# EasyEDA Pro project bldc_driver_board_easyeda_2.eprj, schematic Schematic1
Create Date: 2024-05-04; Page Name: P1; Project Name: bldc_driver_board_easyeda_2; Schematic Name: Schematic1; Update Date: 2024-05-10; Company: EasyEDA.com; Drawn: EasyEDA; Page Size: A4; Part Number: JLCPCB-002; Reviewed: EasyEDA; Version: V0.1
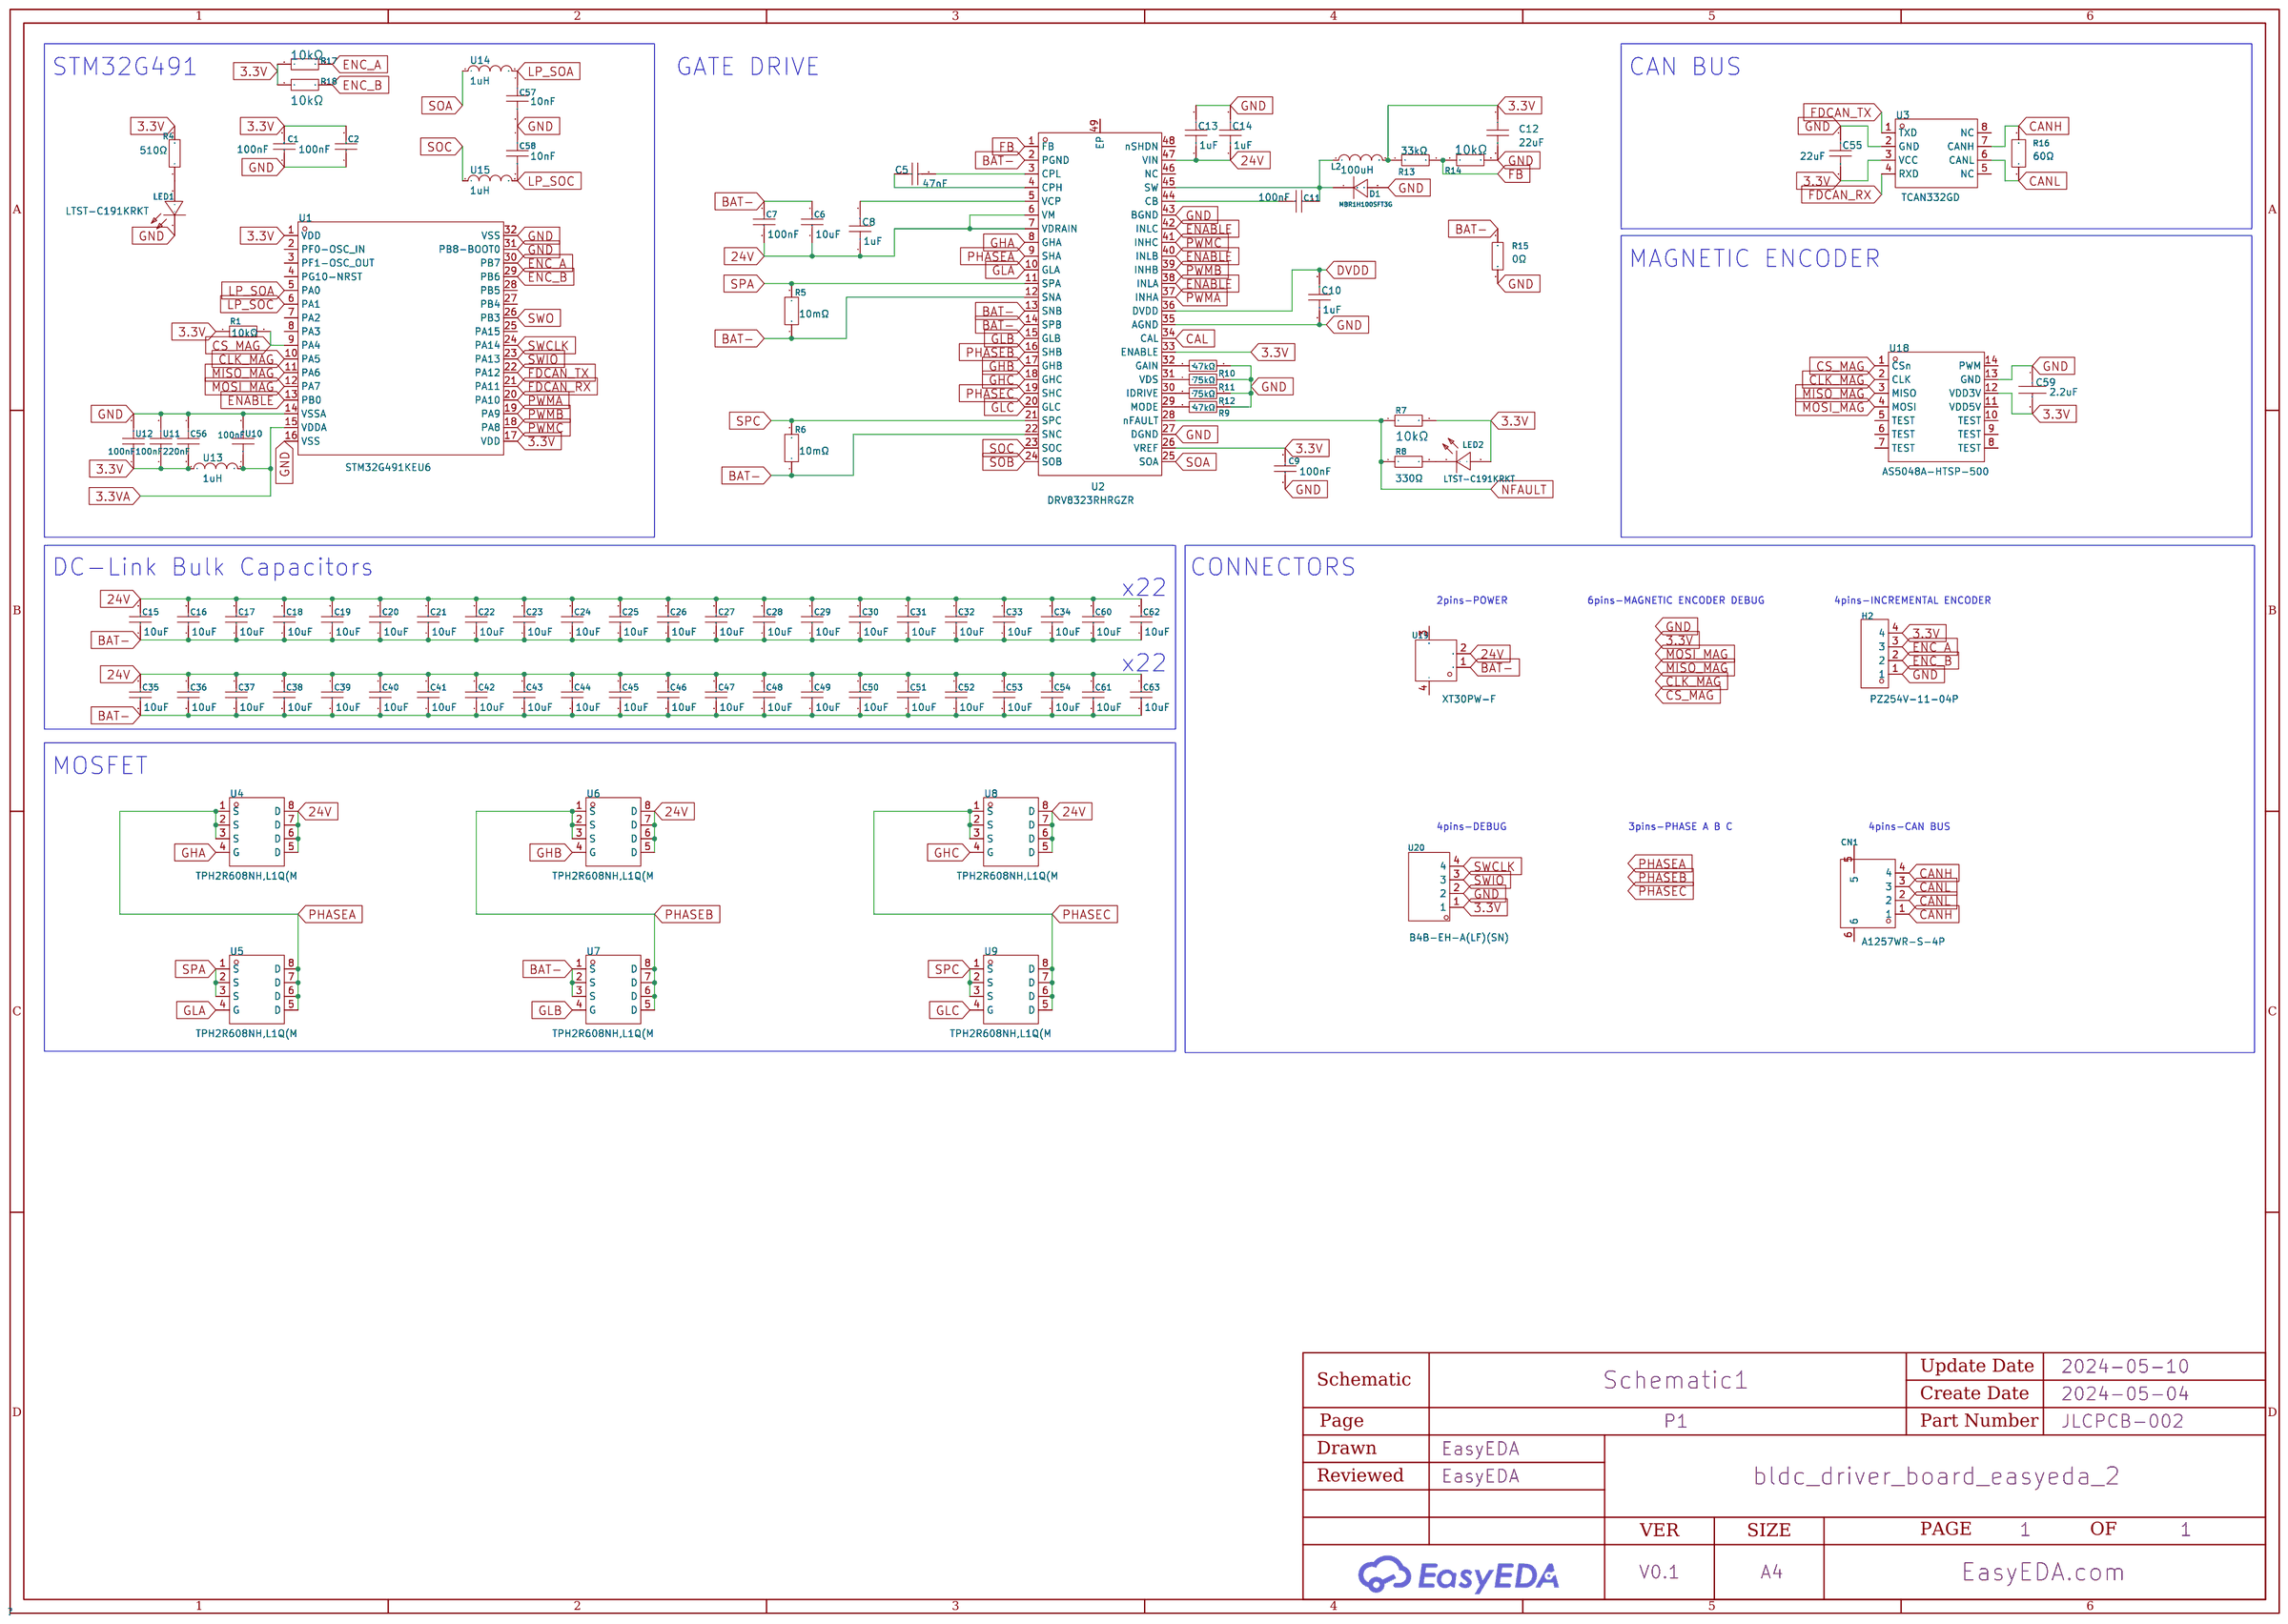
[diagram p0: schematic sheet]

## Parts
C1  100nF  [C0603]
C2  100nF  [C0603]
C5  47nF  [C0805]
C6  10uF  [C1206]
C7  100nF  [C1206]
C8  1uF  [C0603]
C9  100nF  [C0603]
C10  1uF  [C0603]
C11  100nF  [C1206]
C12  22uF  [C0603]
C13  1uF  [C0603]
C14  1uF  [C0603]
C15  10uF  [C1206]
C16  10uF  [C1206]
C17  10uF  [C1206]
C18  10uF  [C1206]
C19  10uF  [C1206]
C20  10uF  [C1206]
C21  10uF  [C1206]
C22  10uF  [C1206]
C23  10uF  [C1206]
C24  10uF  [C1206]
C25  10uF  [C1206]
C26  10uF  [C1206]
C27  10uF  [C1206]
C28  10uF  [C1206]
C29  10uF  [C1206]
C30  10uF  [C1206]
C31  10uF  [C1206]
C32  10uF  [C1206]
C33  10uF  [C1206]
C34  10uF  [C1206]
C35  10uF  [C1206]
C36  10uF  [C1206]
C37  10uF  [C1206]
C38  10uF  [C1206]
C39  10uF  [C1206]
C40  10uF  [C1206]
C41  10uF  [C1206]
C42  10uF  [C1206]
C43  10uF  [C1206]
C44  10uF  [C1206]
C45  10uF  [C1206]
C46  10uF  [C1206]
C47  10uF  [C1206]
C48  10uF  [C1206]
C49  10uF  [C1206]
C50  10uF  [C1206]
C51  10uF  [C1206]
C52  10uF  [C1206]
C53  10uF  [C1206]
C54  10uF  [C1206]
C55  22uF  [C0603]
C56  220nF  [C0603]
C57  10nF  [C0603]
C58  10nF  [C0603]
C59  2.2uF  [C0402]
C60  10uF  [C1206]
C61  10uF  [C1206]
C62  10uF  [C1206]
C63  10uF  [C1206]
CN1  A1257WR-S-4P  [CONN-SMD_A1257WR-S-4P]
D1  MBR1H100SFT3G  [SOD-123F_L2.8-W1.8-LS3.7-RD]
H2  PZ254V-11-04P  [HDR-TH_4P-P2.54-V-M]
L2  100uH  [IND-SMD_L4.0-W4.0]
LED1  LTST-C191KRKT  [LED0603-RD]
LED2  LTST-C191KRKT  [LED0603-RD]
R1  10kΩ  [R0603]
R4  510Ω  [R0603]
R5  10mΩ  [RES-SMD_L6.4-W3.2-R2512]
R6  10mΩ  [RES-SMD_L6.4-W3.2-R2512]
R7  10kΩ  [R0603]
R8  330Ω  [R0603]
R9  47kΩ  [R0603]
R10  47kΩ  [R0603]
R11  75kΩ  [R0603]
R12  75kΩ  [R0603]
R13  33kΩ  [R0603]
R14  10kΩ  [R0603]
R15  0Ω  [R1206]
R16  60Ω  [R0603]
R17  10kΩ  [R0603]
R18  10kΩ  [R0603]
U1  STM32G491KEU6  [UFQFPN-32_L5.0-W5.0-P0.50-TL-1]
U2  DRV8323RHRGZR  [VQFN-48_L7.0-W7.0-P0.50-TL-EP5.1]
U3  TCAN332GD  [SOIC-8_L4.9-W3.9-P1.27-LS6.0-BL]
U4  TPH2R608NH,L1Q(M  [POWERVDFN-8_L5.0-W5.0-P1.27-LS6.0-BL]
U5  TPH2R608NH,L1Q(M  [POWERVDFN-8_L5.0-W5.0-P1.27-LS6.0-BL]
U6  TPH2R608NH,L1Q(M  [POWERVDFN-8_L5.0-W5.0-P1.27-LS6.0-BL]
U7  TPH2R608NH,L1Q(M  [POWERVDFN-8_L5.0-W5.0-P1.27-LS6.0-BL]
U8  TPH2R608NH,L1Q(M  [POWERVDFN-8_L5.0-W5.0-P1.27-LS6.0-BL]
U9  TPH2R608NH,L1Q(M  [POWERVDFN-8_L5.0-W5.0-P1.27-LS6.0-BL]
U10  100nF  [C0603]
U11  100nF  [C0603]
U12  100nF  [C0603]
U13  1uH  [L0603]
U14  1uH  [L0603]
U15  1uH  [L0603]
U18  AS5048A-HTSP-500  [TSSOP-14_L5.0-W4.4-P0.65-LS6.4-BL]
U19  XT30PW-F  [CONN-TH_XT30PW-F-1]
U20  B4B-EH-A(LF)(SN)  [CONN-TH_B4B-EH-A-LF-SN]

## Library data of the parts
C1 C2 C9 = CL10B104KO8NNNC: Capacitance: Tolerance:±10% Tolerance:±10% Voltage Rated: Temperature Coefficient:; LCSC Part Name: 100nF ±10% 16V; Supplier Part: C66501; Manufacturer: SAMSUNG(三星); Supplier Footprint: 0603; JLCPCB Part Class: Extended Part; Datasheet: https://atta.szlcsc.com/upload/public/pdf/source/20160218/1457707763339.pdf; Supplier: LCSC; Tolerance: ±10%
C5 = 0805B473K500NT: Capacitance:47nF Tolerance:±10% Tolerance:±10% Voltage Rated: Temperature Coefficient:; LCSC Part Name: 47nF ±10% 50V; Supplier Part: C1745; Manufacturer: FH(风华); Supplier Footprint: 0805; JLCPCB Part Class: Extended Part; Datasheet: https://atta.szlcsc.com/upload/public/pdf/source/20200305/C486355_26A10D38EF8C2A5C37091D0039909270.pdf; Supplier: LCSC; Tolerance: ±10%
C6 C15-C54 C60-C63 = CL31A106KBHNNNE: Capacitance: Tolerance:±10% Tolerance:±10% Voltage Rated: Temperature Coefficient:; LCSC Part Name: 10uF ±10% 50V; Supplier Part: C13585; Manufacturer: SAMSUNG(三星); Supplier Footprint: 1206; JLCPCB Part Class: Basic Part; Datasheet: https://atta.szlcsc.com/upload/public/pdf/source/20160218/1457707763339.pdf; Supplier: LCSC; Tolerance: ±10%
C7 C11 = 1206B104K500NT: Capacitance:100nF Tolerance:±10% Tolerance:±10% Voltage Rated: Temperature Coefficient:; LCSC Part Name: 100nF ±10% 50V; Supplier Part: C110253; Manufacturer: FH(风华); Supplier Footprint: 1206; JLCPCB Part Class: Extended Part; Datasheet: https://atta.szlcsc.com/upload/public/pdf/source/20200305/C486355_26A10D38EF8C2A5C37091D0039909270.pdf; Supplier: LCSC; Tolerance: ±10%
C8 C10 C13 C14 = CL10A105KB8NNNC: Capacitance: Tolerance:±10% Tolerance:±10% Voltage Rated: Temperature Coefficient:; LCSC Part Name: 1uF ±10% 50V; Supplier Part: C15849; Manufacturer: SAMSUNG(三星); Supplier Footprint: 0603; JLCPCB Part Class: Basic Part; Datasheet: https://atta.szlcsc.com/upload/public/pdf/source/20160218/1457707763339.pdf; Supplier: LCSC; Tolerance: ±10%
C12 C55 = CL10A226MQ8NRNE: Capacitance: Tolerance:±20% Tolerance:±20% Voltage Rated: Temperature Coefficient:; LCSC Part Name: 22uF ±20% 6.3V; Supplier Part: C159801; Manufacturer: SAMSUNG(三星); Supplier Footprint: 0603; JLCPCB Part Class: Extended Part; Datasheet: https://atta.szlcsc.com/upload/public/pdf/source/20160218/1457707763339.pdf; Supplier: LCSC; Tolerance: ±20%
C56 = CL10B224KA8NNNC: Capacitance: Tolerance:±10% Tolerance:±10% Voltage Rated: Temperature Coefficient:; LCSC Part Name: 220nF ±10% 25V; Supplier Part: C21120; Manufacturer: SAMSUNG(三星); Supplier Footprint: 0603; JLCPCB Part Class: Basic Part; Datasheet: https://atta.szlcsc.com/upload/public/pdf/source/20160218/1457707763339.pdf; Supplier: LCSC; Tolerance: ±10%
C57 C58 = CC0603KRX7R9BB103: Capacitance: Tolerance:±10% Tolerance:±10% Voltage Rated: Temperature Coefficient:; LCSC Part Name: 10nF ±10% 50V; Supplier Part: C100042; Manufacturer: YAGEO(国巨); Supplier Footprint: 0603; JLCPCB Part Class: Extended Part; Datasheet: https://atta.szlcsc.com/upload/public/pdf/source/20181008/C309510_22F155564471FAF6A489F7D68F34234E.pdf; Supplier: LCSC; Tolerance: ±10%
C59 = CL05A225MQ5NSNC: Capacitance: Tolerance:±20% Tolerance:±20% Voltage Rated: Temperature Coefficient:; LCSC Part Name: 2.2uF ±20% 6.3V; Supplier Part: C12530; Manufacturer: SAMSUNG(三星); Supplier Footprint: 0402; JLCPCB Part Class: Basic Part; Datasheet: https://atta.szlcsc.com/upload/public/pdf/source/20160218/1457707763339.pdf; Supplier: LCSC; Tolerance: ±20%
CN1 = A1257WR-S-4P: Pins Structure:1x4P Pitch:1.25mm Mounting Style:- Reference Series:GH Number of Pins:4P Number of Rows:1 Number of PINs Per Row:4 Row Spacing:- Contact Material:Brass; LCSC Part Name: 系列:GH 间距:1.25mm 1x4P; Supplier Part: C225127; Manufacturer: CJT(长江连接器); Supplier Footprint: SMD,P=1.25mm; JLCPCB Part Class: Extended Part; Datasheet: https://atta.szlcsc.com/upload/public/pdf/source/20181008/C272994_C9E89FA8A36D0009CAD30AD8C59C2782.pdf; Supplier: LCSC; Pins Structure: 1x4P; Pitch: 1.25mm; Reference Series: GH; Number of Pins: 4P; Number of Rows: 1; Number of PINs Per Row: 4; Contact Material: Brass
D1 = MBR1H100SFT3G: Forward Voltage (Vf@If):760mV@1A Reverse Voltage (Vr):100V Average Rectified Current (Io):1A Reverse Leakage Current (Ir):40uA@100V; LCSC Part Name: 电压:100V 电流:1A; Supplier Part: C235757; Manufacturer: onsemi(安森美); Supplier Footprint: SOD-123FL; JLCPCB Part Class: Extended Part; Datasheet: https://atta.szlcsc.com/upload/public/pdf/source/20221020/1153CD973F1751438771FE3485A9D615.pdf; Supplier: LCSC; Forward Voltage (Vf@If): 760mV@1A; Reverse Voltage (Vr): 100V; Average Rectified Current (Io): 1A; Reverse Leakage Current (Ir): 40uA@100V
H2 = PZ254V-11-04P_C492403: Pin Structure:1x4P Pitch:2.54mm Row Spacing:- Circluar Pins/Square Pins:Square Pins Mounting Type:Straight Number of Rows:Plugin Number of Pins:4P Current Rating (Max):- Voltage Rating (Max):- Length of Mating Pin:6mm Insulation Height:2.5mm Length of End; LCSC Part Name: 间距:2.54mm 1x4P 直插 方针; Supplier Part: C492403; Manufacturer: XFCN(兴飞); Supplier Footprint: 插件,P=2.54mm; JLCPCB Part Class: Extended Part; Datasheet: https://atta.szlcsc.com/upload/public/pdf/source/20200309/C492403_F9F19131791D08044AD4F84F8E751A34.pdf; Supplier: LCSC; Pin Structure: 1x4P; Pitch: 2.54mm; Circluar Pins/Square Pins: Square Pins; Mounting Type: Straight; Number of Rows: Plugin; Number of Pins: 4P; Length of Mating Pin: 6mm; Insulation Height: 2.5mm; Length of End Connection Pin: 3mm; Operating Temperature Range: -40℃~+105℃; Color: Black
L2 = ASPIAIG-S4035-101M-T: Inductance:100uH Tolerance:±20% Tolerance:±20% Rated Current: Saturation Current (Isat):750mA DC Resistance (DCR): Ratings:AEC-Q200; LCSC Part Name: 100uH ±20% 750mA; Supplier Part: C1334632; Manufacturer: ABRACON; Supplier Footprint: SMD,4x4mm; JLCPCB Part Class: Extended Part; Datasheet: https://atta.szlcsc.com/upload/public/pdf/source/20210702/86CE89ECC75CFDE29082610D72370976.pdf; Supplier: LCSC; Tolerance: ±20%; Saturation Current (Isat): 750mA; Ratings: AEC-Q200
LED1 LED2 = LTST-C191KRKT: Emitted Color:Red Forward Voltage (VF):2V Forward Voltage (VF):2V Power Dissipation:75mW Forward Current:20mA Dominant Wavelength:631nm Dominant Wavelength:631nm Peak Wavelength:639nm Diode Configuration:- Lens Color:无色透明透镜 Color Temperature:- Color Tempe; LCSC Part Name: 红灯; Supplier Part: C125099; Manufacturer: LITEON(光宝); Supplier Footprint: 0603; JLCPCB Part Class: Extended Part; Datasheet: https://atta.szlcsc.com/upload/public/pdf/source/20180129/C125099_15171878294931315872.pdf; Supplier: LCSC; Emitted Color: Red; Forward Voltage (VF): 2V; Power Dissipation: 75mW; Forward Current: 20mA; Dominant Wavelength: 631nm; Peak Wavelength: 639nm; Lens Color: 无色透明透镜; Luminous Intensity: 54mcd; Viewing Angle: 130°; Operating Temperature: -55℃~+85℃
R1 R7 R14 R17 R18 = 0603WAF1002T5E: Type:Thick Film Resistors Resistance:10kΩ Tolerance:±1% Tolerance:±1% Power(Watts): Overload Voltage (Max): Temperature Coefficient:±100ppm/℃ Temperature Coefficient:±100ppm/℃ Operating Temperature Range:-55℃~+155℃ Operating Temperature Range:-55℃~+155℃; LCSC Part Name: 厚膜电阻 10kΩ ±1% 100mW; Supplier Part: C25804; Manufacturer: UNI-ROYAL(厚声); Supplier Footprint: 0603; JLCPCB Part Class: Basic Part; Datasheet: https://atta.szlcsc.com/upload/public/pdf/source/20200306/C422600_1E6D84923E4A46A82E41ADD87F860B5C.pdf; Supplier: LCSC; Type: Thick Film Resistors; Tolerance: ±1%; Temperature Coefficient: ±100ppm/℃; Operating Temperature Range: -55℃~+155℃
R4 = 0603WAF5100T5E: Type:Thick Film Resistors Resistance: Tolerance:±1% Tolerance:±1% Power(Watts): Overload Voltage (Max): Temperature Coefficient:±100ppm/℃ Temperature Coefficient:±100ppm/℃ Operating Temperature Range:-55℃~+155℃ Operating Temperature Range:-55℃~+155℃; LCSC Part Name: 510Ω ±1% 100mW 厚膜电阻; Supplier Part: C23193; Manufacturer: UNI-ROYAL(厚声); Supplier Footprint: 0603; JLCPCB Part Class: Basic Part; Datasheet: https://atta.szlcsc.com/upload/public/pdf/source/20200306/C422600_1E6D84923E4A46A82E41ADD87F860B5C.pdf; Supplier: LCSC; Type: Thick Film Resistors; Tolerance: ±1%; Temperature Coefficient: ±100ppm/℃; Operating Temperature Range: -55℃~+155℃
R5 R6 = HoJLR2512-3W-10mR-1%: Type:Current Sensing Resistors Resistance:10mΩ Tolerance:±1% Tolerance:±1% Power(Watts): Mounting Sytle:Surface Mount; LCSC Part Name: 10mΩ ±1% 3W; Supplier Part: C2903468; Manufacturer: Milliohm(毫欧); Supplier Footprint: 2512; JLCPCB Part Class: Extended Part; Datasheet: https://atta.szlcsc.com/upload/public/pdf/source/20211009/7525CABAB363C979E942C1DD41F1FEF0.pdf; Supplier: LCSC; Type: Current Sensing Resistors; Tolerance: ±1%; Mounting Sytle: Surface Mount
R8 = 0603WAF3300T5E: Type:Thick Film Resistors Resistance: Tolerance:±1% Tolerance:±1% Power(Watts): Overload Voltage (Max): Temperature Coefficient:±100ppm/℃ Temperature Coefficient:±100ppm/℃ Operating Temperature Range:-55℃~+155℃ Operating Temperature Range:-55℃~+155℃; LCSC Part Name: 330Ω ±1% 100mW 厚膜电阻; Supplier Part: C23138; Manufacturer: UNI-ROYAL(厚声); Supplier Footprint: 0603; JLCPCB Part Class: Basic Part; Datasheet: https://atta.szlcsc.com/upload/public/pdf/source/20200306/C422600_1E6D84923E4A46A82E41ADD87F860B5C.pdf; Supplier: LCSC; Type: Thick Film Resistors; Tolerance: ±1%; Temperature Coefficient: ±100ppm/℃; Operating Temperature Range: -55℃~+155℃
R9 R10 = 0603WAF4702T5E: Type:Thick Film Resistors Resistance:47kΩ Tolerance:±1% Tolerance:±1% Power(Watts): Overload Voltage (Max): Temperature Coefficient:±100ppm/℃ Temperature Coefficient:±100ppm/℃ Operating Temperature Range:-55℃~+155℃ Operating Temperature Range:-55℃~+155℃; LCSC Part Name: 47kΩ ±1% 100mW 厚膜电阻; Supplier Part: C25819; Manufacturer: UNI-ROYAL(厚声); Supplier Footprint: 0603; JLCPCB Part Class: Basic Part; Datasheet: https://atta.szlcsc.com/upload/public/pdf/source/20200306/C422600_1E6D84923E4A46A82E41ADD87F860B5C.pdf; Supplier: LCSC; Type: Thick Film Resistors; Tolerance: ±1%; Temperature Coefficient: ±100ppm/℃; Operating Temperature Range: -55℃~+155℃
R11 R12 = 0603WAF7502T5E: Type:Thick Film Resistors Resistance:75kΩ Tolerance:±1% Tolerance:±1% Power(Watts): Overload Voltage (Max): Temperature Coefficient:±100ppm/℃ Temperature Coefficient:±100ppm/℃ Operating Temperature Range:-55℃~+155℃ Operating Temperature Range:-55℃~+155℃; LCSC Part Name: 75kΩ ±1% 100mW 厚膜电阻; Supplier Part: C23242; Manufacturer: UNI-ROYAL(厚声); Supplier Footprint: 0603; JLCPCB Part Class: Basic Part; Datasheet: https://atta.szlcsc.com/upload/public/pdf/source/20200306/C422600_1E6D84923E4A46A82E41ADD87F860B5C.pdf; Supplier: LCSC; Type: Thick Film Resistors; Tolerance: ±1%; Temperature Coefficient: ±100ppm/℃; Operating Temperature Range: -55℃~+155℃
R13 = 0603WAF3302T5E: Type:Thick Film Resistors Resistance:33kΩ Tolerance:±1% Tolerance:±1% Power(Watts): Overload Voltage (Max): Temperature Coefficient:±100ppm/℃ Temperature Coefficient:±100ppm/℃ Operating Temperature Range:-55℃~+155℃ Operating Temperature Range:-55℃~+155℃; LCSC Part Name: 33kΩ ±1% 100mW 厚膜电阻; Supplier Part: C4216; Manufacturer: UNI-ROYAL(厚声); Supplier Footprint: 0603; JLCPCB Part Class: Basic Part; Datasheet: https://atta.szlcsc.com/upload/public/pdf/source/20200306/C422600_1E6D84923E4A46A82E41ADD87F860B5C.pdf; Supplier: LCSC; Type: Thick Film Resistors; Tolerance: ±1%; Temperature Coefficient: ±100ppm/℃; Operating Temperature Range: -55℃~+155℃
R15 = 1206W4F0000T5E: Type:Thick Film Resistors Resistance: Tolerance:±1% Tolerance:±1% Power(Watts): Overload Voltage (Max): Temperature Coefficient:±800ppm/℃ Temperature Coefficient:±800ppm/℃ Operating Temperature Range:-55℃~+155℃ Operating Temperature Range:-55℃~+155℃; LCSC Part Name: 0Ω ±1% 250mW 厚膜电阻; Supplier Part: C17888; Manufacturer: UNI-ROYAL(厚声); Supplier Footprint: 1206; JLCPCB Part Class: Basic Part; Datasheet: https://atta.szlcsc.com/upload/public/pdf/source/20200306/C422600_1E6D84923E4A46A82E41ADD87F860B5C.pdf; Supplier: LCSC; Type: Thick Film Resistors; Tolerance: ±1%; Temperature Coefficient: ±800ppm/℃; Operating Temperature Range: -55℃~+155℃
R16 = RTT0360R0FTP: Type:Thick Film Resistors Resistance: Tolerance:±1% Tolerance:±1% Power(Watts): Overload Voltage (Max): Temperature Coefficient:±100ppm/℃ Temperature Coefficient:±100ppm/℃ Operating Temperature Range:-55℃~+155℃ Operating Temperature Range:-55℃~+155℃; LCSC Part Name: 厚膜电阻 60Ω ±1% 100mW; Supplier Part: C166918; Manufacturer: RALEC(旺诠); Supplier Footprint: 0603; JLCPCB Part Class: Extended Part; Datasheet: https://atta.szlcsc.com/upload/public/pdf/source/20180928/C303758_52AE496EA05AD4D633595C32F5A0EBAF.pdf; Supplier: LCSC; Type: Thick Film Resistors; Tolerance: ±1%; Temperature Coefficient: ±100ppm/℃; Operating Temperature Range: -55℃~+155℃
U1 = STM32G491KEU6: CPU Core:- Program Storage Size:512KB GPIO Ports Number:26 Operating Voltage Range:1.71V~3.6V Operating Voltage Range:1.71V~3.6V CPU Maximum Speed:170MHz Operating Temperature Range:-40℃~+85℃ Operating Temperature Range:-40℃~+85℃ ADC (Bit):12bit DAC (Bit); Supplier Part: C3225629; Manufacturer: ST(意法半导体); Supplier Footprint: UFQFPN-32(5x5); JLCPCB Part Class: Extended Part; Datasheet: https://atta.szlcsc.com/upload/public/pdf/source/20221107/0005850207A0EC94E09E1AFE17A81C39.pdf; Supplier: LCSC; Program Storage Size: 512KB; GPIO Ports Number: 26; Operating Voltage Range: 1.71V~3.6V; CPU Maximum Speed: 170MHz; Operating Temperature Range: -40℃~+85℃; ADC (Bit): 12bit; DAC (Bit): 12bit; Universal Serial Bus: 有; Watchdog: 有; Infrared Data Association: 有; Low-Voltage Detect: 有; Direct Memory Access: 有; Internal Oscillator: 有
U2 = DRV8323RHRGZR: Supply Voltage:6V~60V Supply Voltage:6V~60V Operating Temperature:-40℃~+125℃@(Ta) Operating Temperature:-40℃~+125℃@(Ta); Supplier Part: C543035; Manufacturer: TI(德州仪器); Supplier Footprint: VQFN-48-EP(7x7); JLCPCB Part Class: Extended Part; Datasheet: https://www.ti.com/cn/lit/gpn/drv8323r; Supplier: LCSC; Supply Voltage: 6V~60V; Operating Temperature: -40℃~+125℃@(Ta)
U3 = TCAN332GD: Type:Transceiver Data Rate:5Mbps Supply Voltage:3V~3.6V Supply Voltage:3V~3.6V Operating Temperature:-40℃~+125℃ Operating Temperature:-40℃~+125℃; Supplier Part: C1545625; Manufacturer: TI(德州仪器); Supplier Footprint: SOIC-8; JLCPCB Part Class: Extended Part; Datasheet: https://www.ti.com/cn/lit/gpn/tcan332; Supplier: LCSC; Type: Transceiver; Data Rate: 5Mbps; Supply Voltage: 3V~3.6V; Operating Temperature: -40℃~+125℃
U4-U9 = TPH2R608NH,L1Q(M: Supplier Part: C5379811; Manufacturer: TOSHIBA(东芝); Supplier Footprint: SOP-8; Datasheet: https://atta.szlcsc.com/upload/public/pdf/source/20230606/A43572E280778E6E932BD69F3356FB0D.pdf; Supplier: LCSC
U10-U12 = 06036D104KAT2A: Capacitance: Tolerance:±10% Tolerance:±10% Voltage Rated: Temperature Coefficient:; LCSC Part Name: 100nF ±10% 6.3V; Supplier Part: C1856510; Manufacturer: Kyocera AVX; Supplier Footprint: 0603; JLCPCB Part Class: Extended Part; Datasheet: https://atta.szlcsc.com/upload/public/pdf/source/20210630/E771284EE21E0F270718F23EFAB9C321.pdf; Supplier: LCSC; Tolerance: ±10%
U13-U15 = YL160808-1R0K: Inductance: Tolerance:±10% Tolerance:±10% Rated Current: Saturation Current (Isat):- DC Resistance (DCR): Q @ Freq:35@10MHz Frequency - Self Resonant: Ratings:; LCSC Part Name: 1uH ±10%; Supplier Part: C2839970; Manufacturer: YJYCOIN(益嘉源); Supplier Footprint: 0603; JLCPCB Part Class: Extended Part; Datasheet: https://atta.szlcsc.com/upload/public/pdf/source/20210615/C2839970_ABC794F14AEDE076178322CDBBF81D48.pdf; Supplier: LCSC; Tolerance: ±10%; Q @ Freq: 35@10MHz
U18 = AS5048A-HTSP-500: Supply Voltage:3V~3.6V；4.5V~5.5V Supply Voltage:3V~3.6V；4.5V~5.5V Rotation Angle:0°~360° Rotation Angle:0°~360°; Supplier Part: C2655181; Manufacturer: ams(艾迈斯半导体); Supplier Footprint: TSSOP-14; JLCPCB Part Class: Extended Part; Datasheet: https://atta.szlcsc.com/upload/public/pdf/source/20210429/095640A91DD735A5214A8BC6EE68F312.pdf; Supplier: LCSC; Supply Voltage: 3V~3.6V；4.5V~5.5V; Rotation Angle: 0°~360°
U19 = XT30PW-F: Brand:艾迈斯 Model:XT30PW-F Power:- Output:- Input:- Size:- Interface:- Type:- Colour:- MaximumCurrent:- Type:航模插头 RatedVoltage:- Type1:- NumberOfUSBHoles:- InterfaceType:母头 MetalMaterial:- InsulationMaterial:- RatedCurrent:- RecommendedWireGauge:- FlameReta; LCSC Part Name: AMASS(艾迈斯)电源连接器 母头 XT30PW-F; Supplier Part: C2913282; Manufacturer: AMASS(艾迈斯); JLCPCB Part Class: Extended Part; Datasheet: https://atta.szlcsc.com/upload/public/pdf/source/20231218/06CFCF98887A9A87638B0856A725C8FD.pdf; Supplier: LCSC; Brand: 艾迈斯; Type: 航模插头; InterfaceType: 母头
U20 = B4B-EH-A(LF)(SN): Pins Structure:1x4P Pitch:2.5mm Mounting Style:- Reference Series:EH Number of Pins:4P Number of Rows:1 Number of PINs Per Row:4 Row Spacing:- Contact Material:Brass; Supplier Part: C160258; Manufacturer: JST; Supplier Footprint: 插件,P=2.5mm; JLCPCB Part Class: Extended Part; Datasheet: https://atta.szlcsc.com/upload/public/pdf/source/20180829/C265103_11C5AD83FCD48B5E904586D0E75EE570.pdf; Supplier: LCSC; Pins Structure: 1x4P; Pitch: 2.5mm; Reference Series: EH; Number of Pins: 4P; Number of Rows: 1; Number of PINs Per Row: 4; Contact Material: Brass

## Nets
3.3V: C1.2 C2.2 C9.2 C12.1 C55.2 C56.2 C59.2 H2.4 L2.2 LED2.2(+) R1.1 R4.2 R7.2 R13.1 R17.1 R18.1 U1.1(VDD) U1.17(VDD) U2.26(VREF) U2.33(ENABLE) U3.3(VCC) U11.1 U12.1 U13.1 U18.12(VDD3V) U20.1
3.3VA: U1.15(VDDA) U10.1 U13.2
24V: C6.1 C7.1 C8.1 C13.1 C14.1 C15.2 C16.2 C17.2 C18.2 C19.2 C20.2 C21.2 C22.2 C23.2 C24.2 C25.2 C26.2 C27.2 C28.2 C29.2 C30.2 C31.2 C32.2 C33.2 C34.2 C35.2 C36.2 C37.2 C38.2 C39.2 C40.2 C41.2 C42.2 C43.2 C44.2 C45.2 C46.2 C47.2 C48.2 C49.2 C50.2 C51.2 C52.2 C53.2 C54.2 C60.2 C61.2 C62.2 C63.2 U2.6(VM) U2.7(VDRAIN) U2.47(VIN) U4.5(D) U4.6(D) U4.7(D) U4.8(D) U6.5(D) U6.6(D) U6.7(D) U6.8(D) U8.5(D) U8.6(D) U8.7(D) U8.8(D) U19.2
DVDD: C10.2 U2.36(DVDD)
GND: C1.1 C2.1 C9.1 C10.1 C12.2 C13.2 C14.2 C55.1 C56.1 C57.2 C58.1 C59.1 D1.2(A) H2.1 LED1.1(-) R9.2 R10.2 R11.2 R12.2 R14.2 R15.1 U1.14(VSSA) U1.16(VSS) U1.31(PB8-BOOT0) U1.32(VSS) U2.27(DGND) U2.35(AGND) U2.43(BGND) U3.2(GND) U10.2 U11.2 U12.2 U18.13(GND) U20.2
BAT-: C6.2 C7.2 C15.1 C16.1 C17.1 C18.1 C19.1 C20.1 C21.1 C22.1 C23.1 C24.1 C25.1 C26.1 C27.1 C28.1 C29.1 C30.1 C31.1 C32.1 C33.1 C34.1 C35.1 C36.1 C37.1 C38.1 C39.1 C40.1 C41.1 C42.1 C43.1 C44.1 C45.1 C46.1 C47.1 C48.1 C49.1 C50.1 C51.1 C52.1 C53.1 C54.1 C60.1 C61.1 C62.1 C63.1 R5.1 R6.1 R15.2 U2.2(PGND) U2.12(SNA) U2.13(SNB) U2.14(SPB) U2.22(SNC) U7.1(S) U7.2(S) U7.3(S) U19.1
CAL: U2.34(CAL)
CANH: CN1.1 CN1.4 R16.2 U3.7(CANH)
CANL: CN1.2 CN1.3 R16.1 U3.6(CANL)
CLK_MAG: U1.10(PA5) U18.2(CLK)
CS_MAG: R1.2 U1.9(PA4) U18.1(CSn)
ENABLE: U1.13(PB0) U2.38(INLA) U2.40(INLB) U2.42(INLC)
ENC_A: H2.3 R17.2 U1.30(PB7)
ENC_B: H2.2 R18.2 U1.29(PB6)
FB: R13.2 R14.1 U2.1(FB)
FDCAN_RX: U1.21(PA11) U3.4(RXD)
FDCAN_TX: U1.22(PA12) U3.1(TXD)
GHA: U2.8(GHA) U4.4(G)
GHB: U2.17(GHB) U6.4(G)
GHC: U2.18(GHC) U8.4(G)
GLA: U2.10(GLA) U5.4(G)
GLB: U2.15(GLB) U7.4(G)
GLC: U2.20(GLC) U9.4(G)
LP_SOA: C57.1 U1.5(PA0) U14.2
LP_SOC: C58.2 U1.6(PA1) U15.2
MISO_MAG: U1.11(PA6) U18.3(MISO)
MOSI_MAG: U1.12(PA7) U18.4(MOSI)
NFAULT: R7.1 R8.1 U2.28(nFAULT)
PHASEA: U2.9(SHA) U4.1(S) U4.2(S) U4.3(S) U5.5(D) U5.6(D) U5.7(D) U5.8(D)
PHASEB: U2.16(SHB) U6.1(S) U6.2(S) U6.3(S) U7.5(D) U7.6(D) U7.7(D) U7.8(D)
PHASEC: U2.19(SHC) U8.1(S) U8.2(S) U8.3(S) U9.5(D) U9.6(D) U9.7(D) U9.8(D)
PWMA: U1.20(PA10) U2.37(INHA)
PWMB: U1.19(PA9) U2.39(INHB)
PWMC: U1.18(PA8) U2.41(INHC)
SOA: U2.25(SOA) U14.1
SOB: U2.24(SOB)
SOC: U2.23(SOC) U15.1
SPA: R5.2 U2.11(SPA) U5.1(S) U5.2(S) U5.3(S)
SPC: R6.2 U2.21(SPC) U9.1(S) U9.2(S) U9.3(S)
SWCLK: U1.24(PA14) U20.4
SWIO: U1.23(PA13) U20.3
SWO: U1.26(PB3)
$1N3020: LED1.2(+) R4.1
$1N3116: C5.2 U2.3(CPL)
$1N3119: C5.1 U2.4(CPH)
$1N3348: C8.2 U2.5(VCP)
$1N4267: LED2.1(-) R8.2
$1N4347: R9.1 U2.29(MODE)
$1N4386: R10.1 U2.32(GAIN)
$1N4470: R11.1 U2.31(VDS)
$1N4546: R12.1 U2.30(IDRIVE)
$1N4795: C11.2 U2.44(CB)
$1N4956: C11.1 D1.1(C) L2.1 U2.45(SW)

Not connected (* = marked no-connect by the designer): CN1 5 6; U1 2(PF0-OSC_IN) 3(PF1-OSC_OUT) 4(PG10-NRST) 7(PA2) 8(PA3) 25(PA15) 27(PB4) 28(PB5); U2 46(NC) 48(nSHDN) 49(EP); U3 5(NC) 8(NC); U18 5(TEST) 6(TEST) 7(TEST) 8(TEST) 9(TEST) 10(TEST) 11(VDD5V) 14(PWM); U19 3 4

## Notes on the sheet
- STM32G491
- GATE DRIVE
- CAN BUS
- MAGNETIC ENCODER
- DC-Link Bulk Capacitors
- CONNECTORS
- x22
- 2pins-POWER
- 6pins-MAGNETIC ENCODER DEBUG
- 4pins-INCREMENTAL ENCODER
- x22
- MOSFET
- 4pins-DEBUG
- 3pins-PHASE A B C
- 4pins-CAN BUS
